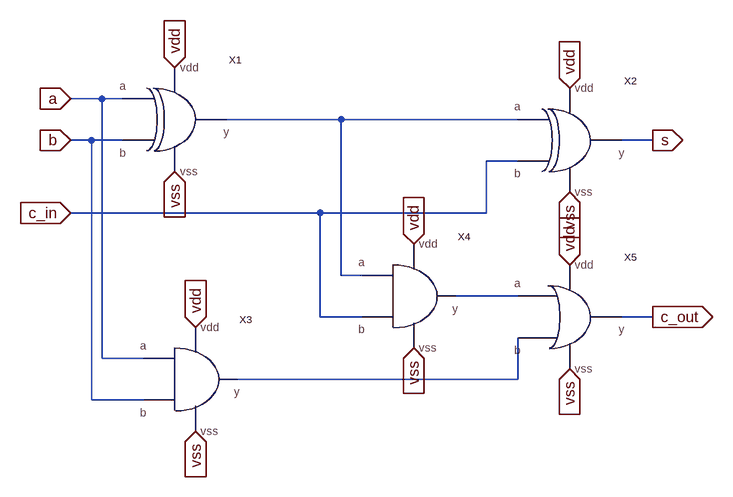
[diagram p0: schematic full_adder.asc]
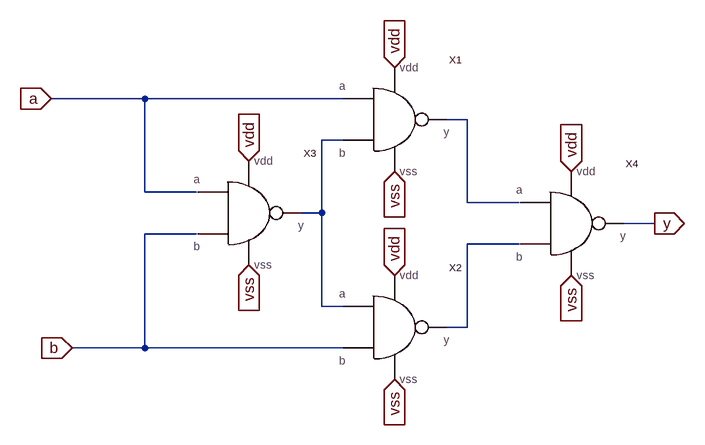
[diagram p1: sub-circuit xor.asc]
full_adder.asc, the LTspice schematic file:
Version 4
SHEET 1 1124 680
WIRE 128 -80 80 -80
WIRE 160 -80 128 -80
WIRE 496 -48 320 -48
WIRE 768 -48 496 -48
WIRE 112 -16 80 -16
WIRE 160 -16 112 -16
WIRE 976 -16 928 -16
WIRE 768 16 720 16
WIRE 464 96 80 96
WIRE 720 96 720 16
WIRE 720 96 464 96
WIRE 496 192 496 -48
WIRE 528 192 496 192
WIRE 768 224 672 224
WIRE 464 256 464 96
WIRE 528 256 464 256
WIRE 976 256 928 256
WIRE 128 320 128 -80
WIRE 192 320 128 320
WIRE 768 352 768 288
WIRE 768 352 336 352
WIRE 112 384 112 -16
WIRE 192 384 112 384
FLAG 80 -80 a
IOPIN 80 -80 In
FLAG 240 -128 vdd
IOPIN 240 -128 In
FLAG 976 -16 s
IOPIN 976 -16 Out
FLAG 240 32 vss
IOPIN 240 32 In
FLAG 80 -16 b
IOPIN 80 -16 In
FLAG 848 -96 vdd
IOPIN 848 -96 In
FLAG 848 64 vss
IOPIN 848 64 In
FLAG 80 96 c_in
IOPIN 80 96 In
FLAG 272 272 vdd
IOPIN 272 272 In
FLAG 272 432 vss
IOPIN 272 432 In
FLAG 608 144 vdd
IOPIN 608 144 In
FLAG 608 304 vss
IOPIN 608 304 In
FLAG 976 256 c_out
IOPIN 976 256 Out
FLAG 848 176 vdd
IOPIN 848 176 In
FLAG 848 336 vss
IOPIN 848 336 In
SYMBOL xor 240 -48 R0
SYMATTR InstName X1
SYMBOL xor 848 -16 R0
SYMATTR InstName X2
SYMBOL and 272 352 R0
SYMATTR InstName X3
SYMBOL and 608 224 R0
SYMATTR InstName X4
SYMBOL or 848 256 R0
SYMATTR InstName X5

xor.asc, the sub-circuit schematic file:
Version 4
SHEET 1 1608 784
WIRE 144 128 0 128
WIRE 448 128 144 128
WIRE 640 160 608 160
WIRE 448 192 416 192
WIRE 144 272 144 128
WIRE 224 272 144 272
WIRE 640 288 640 160
WIRE 720 288 640 288
WIRE 416 304 416 192
WIRE 416 304 384 304
WIRE 928 320 880 320
WIRE 224 336 144 336
WIRE 720 352 640 352
WIRE 416 448 416 304
WIRE 448 448 416 448
WIRE 640 480 640 352
WIRE 640 480 608 480
WIRE 144 512 144 336
WIRE 144 512 32 512
WIRE 448 512 144 512
FLAG 0 128 a
IOPIN 0 128 In
FLAG 928 320 y
IOPIN 928 320 Out
FLAG 32 512 b
IOPIN 32 512 In
FLAG 304 224 vdd
IOPIN 304 224 In
FLAG 304 384 vss
IOPIN 304 384 In
FLAG 528 80 vdd
IOPIN 528 80 In
FLAG 528 240 vss
IOPIN 528 240 In
FLAG 528 400 vdd
IOPIN 528 400 In
FLAG 528 560 vss
IOPIN 528 560 In
FLAG 800 240 vdd
IOPIN 800 240 In
FLAG 800 400 vss
IOPIN 800 400 In
SYMBOL nand 304 304 R0
SYMATTR InstName X3
SYMBOL nand 528 160 R0
SYMATTR InstName X1
SYMBOL nand 528 480 R0
SYMATTR InstName X2
SYMBOL nand 800 320 R0
SYMATTR InstName X4

The netlist it stands for:
* full_adder.asc
XX1 a b N001 vdd vss xor
XX2 N001 c_in s vdd vss xor
XX3 a b N003 vdd vss and  ; pins a b y vdd vss
XX4 N001 c_in N002 vdd vss and  ; pins a b y vdd vss
XX5 N002 N003 c_out vdd vss or  ; pins a b y vdd vss

* block symbol definitions
.subckt xor a b y vdd vss
XX3 a b N002 vdd vss nand  ; pins a b y vdd vss
XX1 a N002 N001 vdd vss nand  ; pins a b y vdd vss
XX2 N002 b N003 vdd vss nand  ; pins a b y vdd vss
XX4 N001 N003 y vdd vss nand  ; pins a b y vdd vss
.ends xor

.backanno
.end